# EAGLE design 8_bit_Middle_Rev_A (EAGLE 9.6.0)

## Sheet 1 of 2
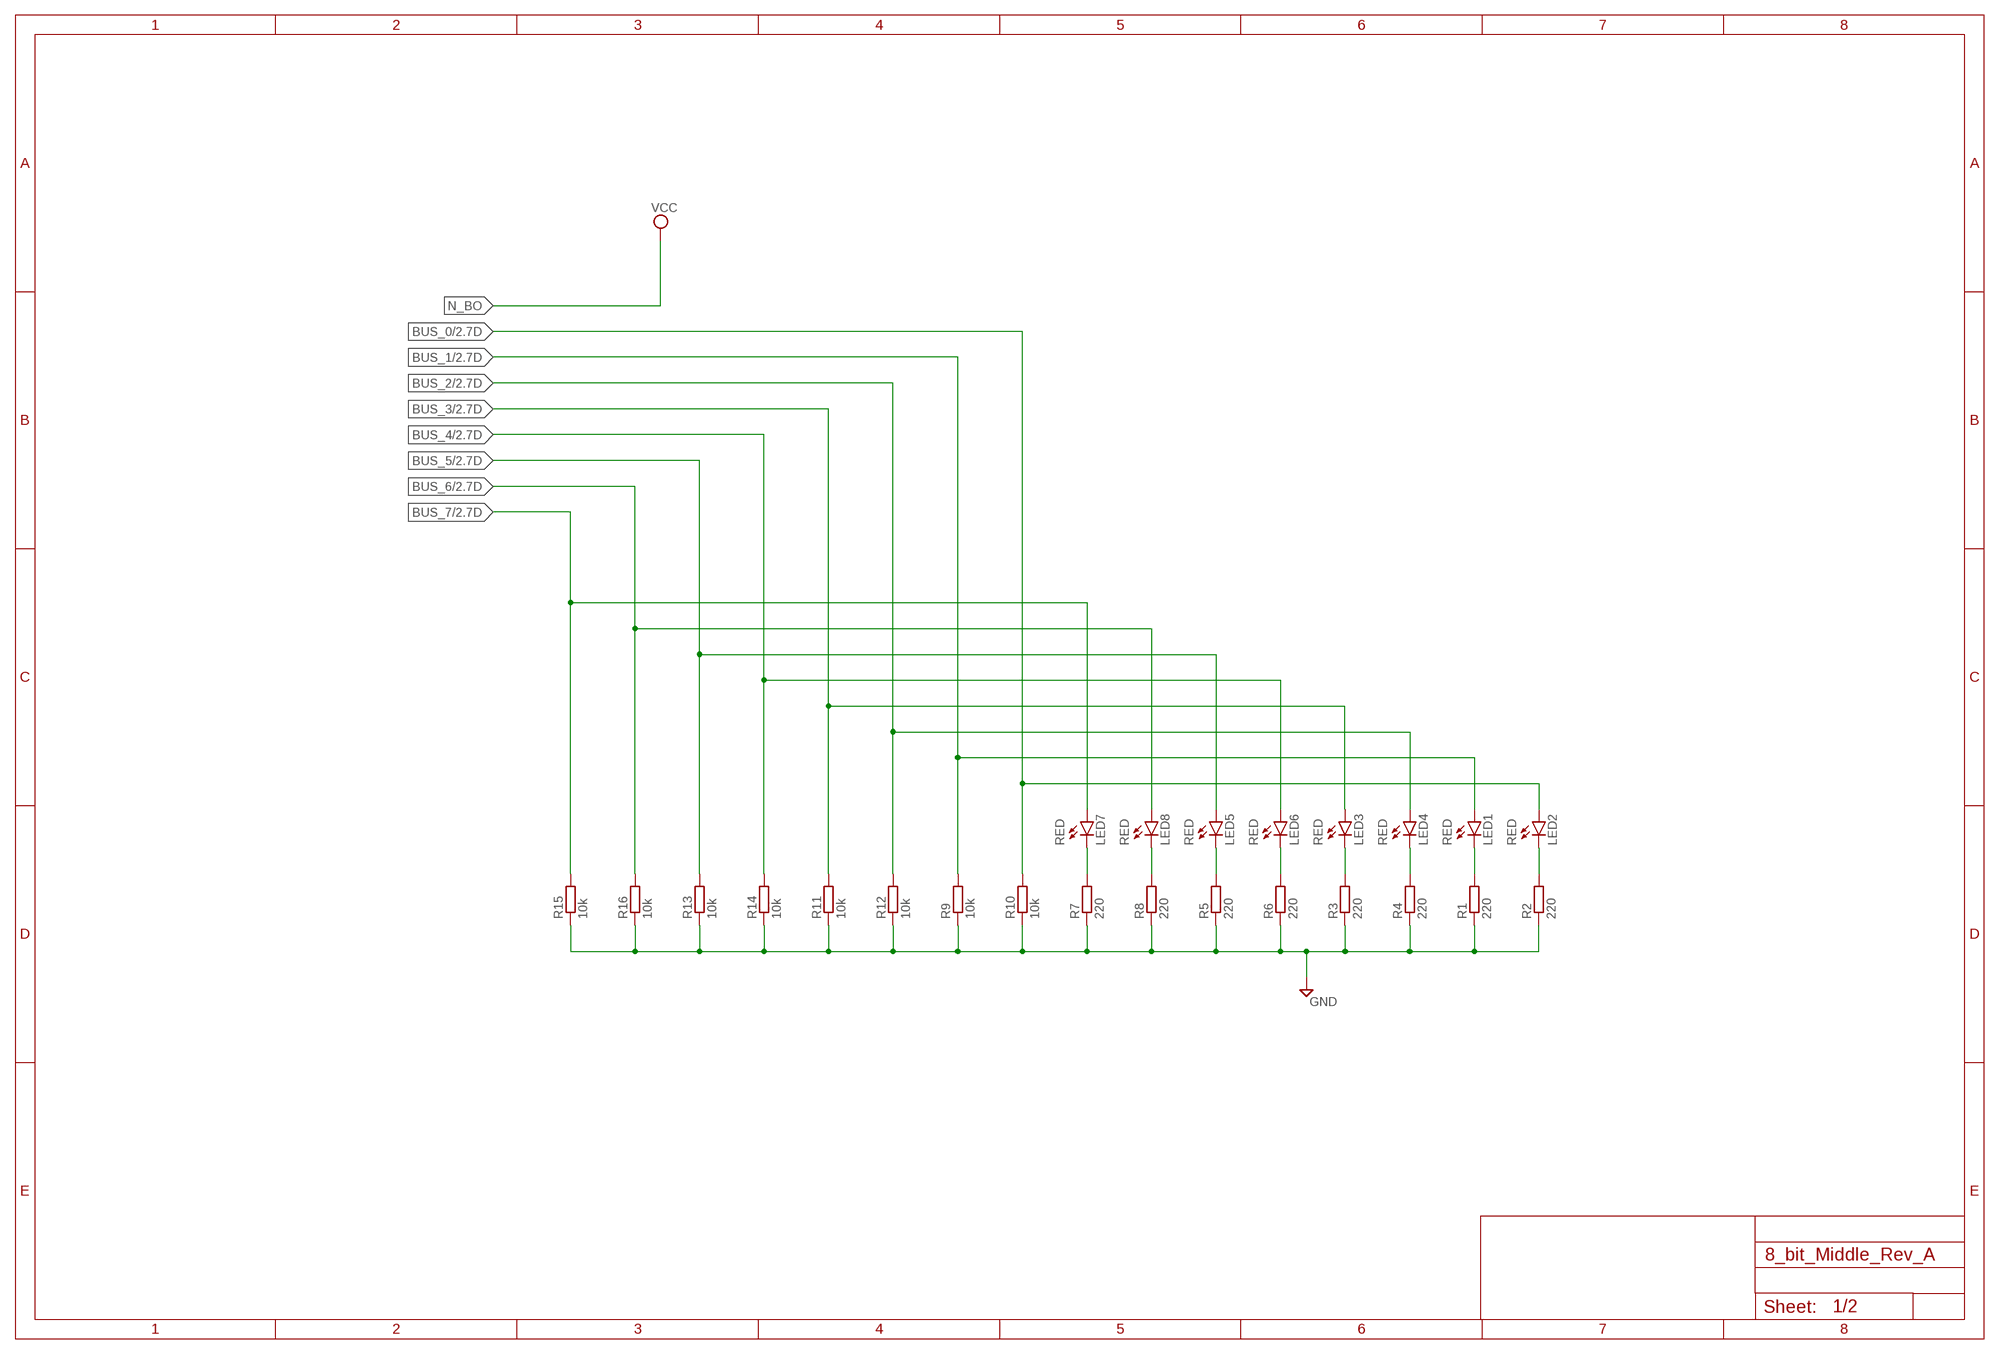
[diagram p0: schematic, sheet 1]

### Parts
LED1  RED  LED5MM  [LED5MM]
LED2  RED  LED5MM  [LED5MM]
LED3  RED  LED5MM  [LED5MM]
LED4  RED  LED5MM  [LED5MM]
LED5  RED  LED5MM  [LED5MM]
LED6  RED  LED5MM  [LED5MM]
LED7  RED  LED5MM  [LED5MM]
LED8  RED  LED5MM  [LED5MM]
R1  220  R-EU_0207/10  [0207/10]
R2  220  R-EU_0207/10  [0207/10]
R3  220  R-EU_0207/10  [0207/10]
R4  220  R-EU_0207/10  [0207/10]
R5  220  R-EU_0207/10  [0207/10]
R6  220  R-EU_0207/10  [0207/10]
R7  220  R-EU_0207/10  [0207/10]
R8  220  R-EU_0207/10  [0207/10]
R9  10k  R-EU_0207/10  [0207/10]
R10  10k  R-EU_0207/10  [0207/10]
R11  10k  R-EU_0207/10  [0207/10]
R12  10k  R-EU_0207/10  [0207/10]
R13  10k  R-EU_0207/10  [0207/10]
R14  10k  R-EU_0207/10  [0207/10]
R15  10k  R-EU_0207/10  [0207/10]
R16  10k  R-EU_0207/10  [0207/10]

### Nets
BUS_0: LED2.A R10.2 ; also sheet 2
BUS_1: LED1.A R9.2 ; also sheet 2
BUS_2: LED4.A R12.2 ; also sheet 2
BUS_3: LED3.A R11.2 ; also sheet 2
BUS_4: LED6.A R14.2 ; also sheet 2
BUS_5: LED5.A R13.2 ; also sheet 2
BUS_6: LED8.A R16.2 ; also sheet 2
BUS_7: LED7.A R15.2 ; also sheet 2
GND: R1.1 R2.1 R3.1 R4.1 R5.1 R6.1 R7.1 R8.1 R9.1 R10.1 R11.1 R12.1 R13.1 R14.1 R15.1 R16.1 ; also sheet 2
GND1: LED1.K(C) R1.2
GND2: LED2.K(C) R2.2
GND3: LED3.K(C) R3.2
GND5: LED4.K(C) R4.2
GND7: LED5.K(C) R5.2
GND8: LED6.K(C) R6.2
GND9: LED7.K(C) R7.2
GND10: LED8.K(C) R8.2

## Sheet 2 of 2
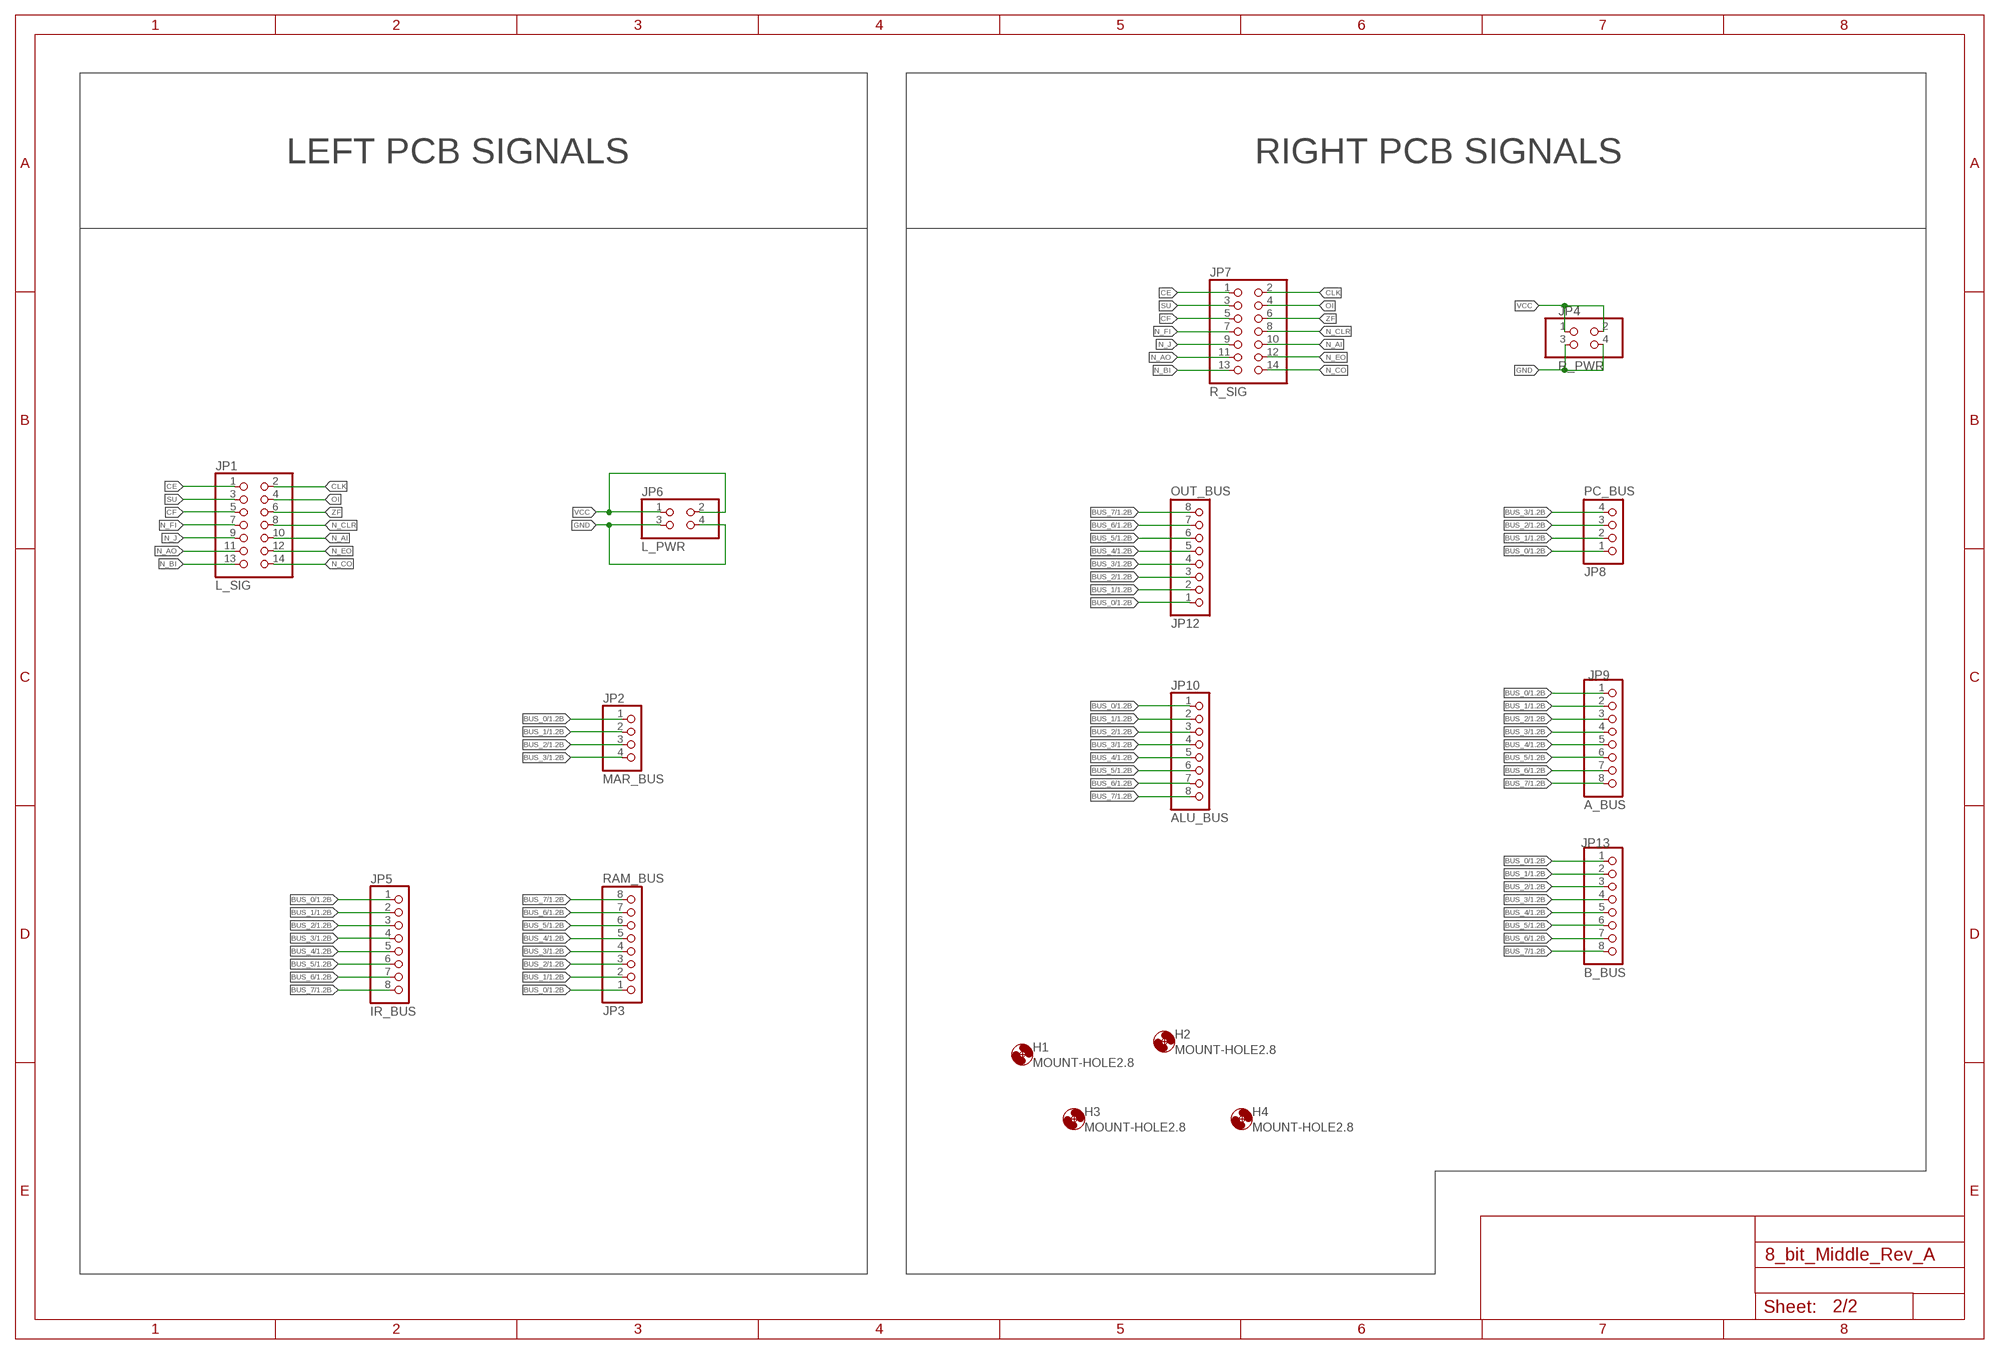
[diagram p1: schematic, sheet 2]

### Parts
H1  MOUNT-HOLE2.8  [2,8]
H2  MOUNT-HOLE2.8  [2,8]
H3  MOUNT-HOLE2.8  [2,8]
H4  MOUNT-HOLE2.8  [2,8]
JP1  L_SIG  PINHD-2X7  [2X07]
JP2  MAR_BUS  PINHD-1X4  [1X04]
JP3  RAM_BUS  PINHD-1X8  [1X08]
JP4  R_PWR  PINHD-2X2  [2X02]
JP5  IR_BUS  PINHD-1X8  [1X08]
JP6  L_PWR  PINHD-2X2  [2X02]
JP7  R_SIG  PINHD-2X7  [2X07]
JP8  PC_BUS  PINHD-1X4  [1X04]
JP9  A_BUS  PINHD-1X8  [1X08]
JP10  ALU_BUS  PINHD-1X8  [1X08]
JP12  OUT_BUS  PINHD-1X8  [1X08]
JP13  B_BUS  PINHD-1X8  [1X08]

### Nets
BUS_0: JP2.1 JP3.1 JP5.1 JP8.1 JP9.1 JP10.1 JP12.1 JP13.1 ; also sheet 1
BUS_1: JP2.2 JP3.2 JP5.2 JP8.2 JP9.2 JP10.2 JP12.2 JP13.2 ; also sheet 1
BUS_2: JP2.3 JP3.3 JP5.3 JP8.3 JP9.3 JP10.3 JP12.3 JP13.3 ; also sheet 1
BUS_3: JP2.4 JP3.4 JP5.4 JP8.4 JP9.4 JP10.4 JP12.4 JP13.4 ; also sheet 1
BUS_4: JP3.5 JP5.5 JP9.5 JP10.5 JP12.5 JP13.5 ; also sheet 1
BUS_5: JP3.6 JP5.6 JP9.6 JP10.6 JP12.6 JP13.6 ; also sheet 1
BUS_6: JP3.7 JP5.7 JP9.7 JP10.7 JP12.7 JP13.7 ; also sheet 1
BUS_7: JP3.8 JP5.8 JP9.8 JP10.8 JP12.8 JP13.8 ; also sheet 1
CE: JP1.1 JP7.1
CF: JP1.5 JP7.5
CLK: JP1.2 JP7.2
GND: JP4.3 JP4.4 JP6.3 JP6.4 ; also sheet 1
N_AI: JP1.10 JP7.10
N_AO: JP1.11 JP7.11
N_BI: JP1.13 JP7.13
N_CLR: JP1.8 JP7.8
N_CO: JP1.14 JP7.14
N_EO: JP1.12 JP7.12
N_FI: JP1.7 JP7.7
N_J: JP1.9 JP7.9
OI: JP1.4 JP7.4
SU: JP1.3 JP7.3
VCC [zasilanie]: JP4.1 JP4.2 JP6.1 JP6.2
ZF: JP1.6 JP7.6

### Notes on the sheet
- LEFT PCB SIGNALS | RIGHT PCB SIGNALS

## Library data of the parts
H1-H4 = holes:MOUNT-HOLE: MOUNTING HOLE with drill center marker
JP1 JP7 = pinhead:PINHD-2X7: PIN HEADER
JP2 JP8 = pinhead:PINHD-1X4: PIN HEADER
JP3 JP5 JP9 JP10 JP12 JP13 = pinhead:PINHD-1X8: PIN HEADER
JP4 JP6 = pinhead:PINHD-2X2: PIN HEADER
LED1-LED8 = led:LED: LED OSRAM: - CHIPLED LG R971, LG N971, LY N971, LG Q971, LY Q971, LO R971, LY R971 LH N974, LH R974 LS Q976, LO Q976, LY Q976 LO Q996 - Hyper CHIPLED LW Q18S LB Q993, LB Q99A, LB R99A - SideLED LS A670, LO A670, LY A670, LG A670, LP A670 LB A673, LV A673, LT A673, LW A673 LH A674 LY A675 LS A676, LA A676, LO A676, LY A676, LW A676 LS A679, LY A679, LG A679 - Hyper Micro SIDELED® LS Y876, LA Y876, LO Y876, LY Y876 LT Y87S - SmartLED LW L88C, LW L88S LB L89C, LB L89S, LG L890 LS L89K, LO L89K, LY L89K LS L896, LA L896, LO L896, LY L896 - TOPLED LS T670, LO T670, LY T670, LG T670, LP T670 LSG T670, LSP T670, LSY T670, LOP T670, LYG T670 LG T671, LOG T671, LSG T671 LB T673, LV T673, LT T673, LW T673 LH T674 LS T676, LA T676, LO T676, LY T676, LB T676, LH T676, LSB T676, LW T676 LB T67C, LV T67C, LT T67C, LS T67K, LO T67K, LY T67K, LW E67C LS E67B, LA E67B, LO E67B, LY E67B, LB E67C, LV E67C, LT E67C LW T67C LS T679, LY T679, LG T679 LS T770, LO T770, LY T770, LG T770, LP T770 LB T773, LV T773, LT T773, LW T773 LH T774 LS E675, LA E675, LY E675, LS T675 LS T776, LA T776, LO T776, LY T776, LB T776 LHGB T686 LT T68C, LB T68C - Hyper Mini TOPLED® LB M676 - Mini TOPLED Santana® LG M470 LS M47K, LO M47K, LY M47K Source: http://www.osram.convergy.de LUXEON: - LUMILED® LXK2-PW12-R00, LXK2-PW12-S00, LXK2-PW14-U00, LXK2-PW14-V00 LXK2-PM12-R00, LXK2-PM12-S00, LXK2-PM14-U00 LXK2-PE12-Q00, LXK2-PE12-R00, LXK2-PE12-S00, LXK2-PE14-T00, LXK2-PE14-U00 LXK2-PB12-K00, LXK2-PB12-L00, LXK2-PB12-M00, LXK2-PB14-N00, LXK2-PB14-P00, LXK2-PB14-Q00 LXK2-PR12-L00, LXK2-PR12-M00, LXK2-PR14-Q00, LXK2-PR14-R00 LXK2-PD12-Q00, LXK2-PD12-R00, LXK2-PD12-S00 LXK2-PH12-R00, LXK2-PH12-S00 LXK2-PL12-P00, LXK2-PL12-Q00, LXK2-PL12-R00 Source: www.luxeon.com KINGBRIGHT: KA-3528ASYC Source: www.kingbright.com
R1-R16 = rcl:R-EU_: RESISTOR, European symbol; SPICEPREFIX: R

## Net classes
1 zasilanie: width 0.508 mm

## Board
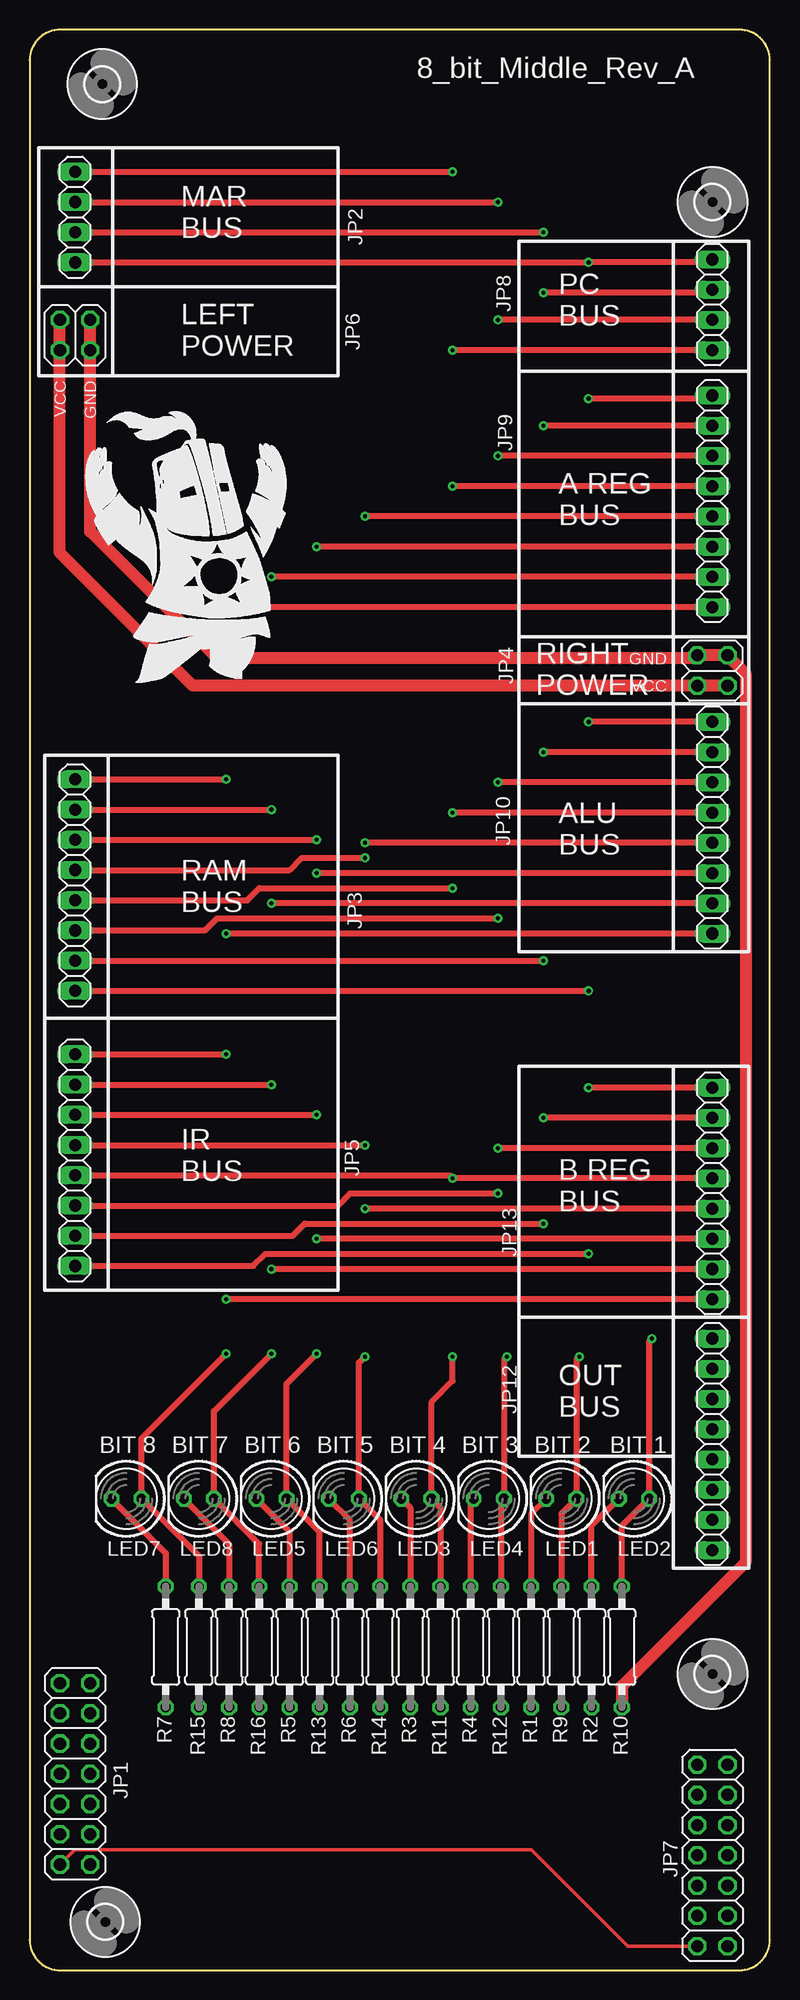
[diagram p2: board, top side]
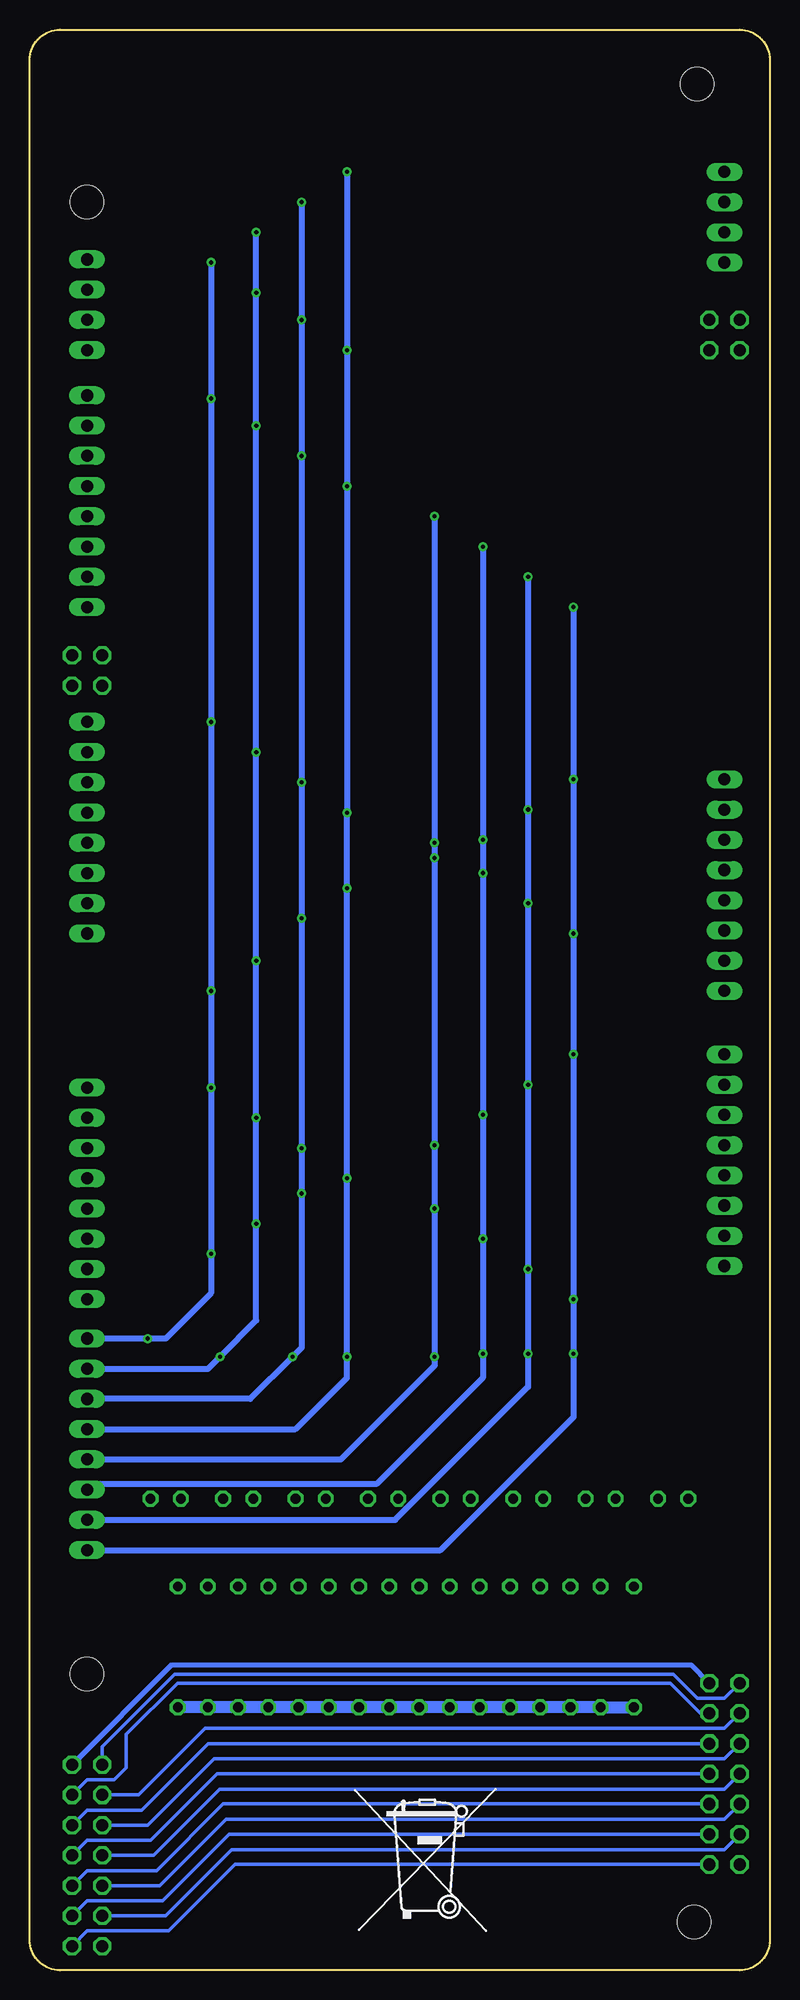
[diagram p3: board, bottom side, seen from below]

Size 62.23 x 163.07 mm. Coordinates in mm from the lower left corner, seen from the top.
Outline: 0,160.53 0,2.54 arc90 2.54,0 59.69,0 arc90 62.23,2.54 62.23,160.53 arc90 59.69,163.07 2.54,163.07 arc90 0,160.53
Copper layers (1*16): Top 0.035mm / dielectric 1.5mm / Bottom 0.035mm
Design rules "default": minimum track width 6mil, minimum drill 0.35mm, track to track 6mil, track to pad 6mil, pad to pad 6mil, via to via 6mil, smd to smd 6mil, copper to edge 40mil, drill to drill 6mil, minimum pad ring 10mil, minimum via ring 8mil, stop-mask expansion 4mil, vias tented up to drill 0mil, thermal gap 10mil

### Footprints (pad centres in the part's own frame; a part is rotated, then mirrored left to right if it is on the bottom)
2,8 = hole 2.8: 0,0
2X07 = drill 1.016 octagon: 1 -7.62,-1.27; 2 -7.62,1.27; 3 -5.08,-1.27; 4 -5.08,1.27; 5 -2.54,-1.27; 6 -2.54,1.27; 7 0,-1.27; 8 0,1.27; 9 2.54,-1.27; 10 2.54,1.27; 11 5.08,-1.27; 12 5.08,1.27; 13 7.62,-1.27; 14 7.62,1.27
1X04 = drill 1.016 long: 1 -3.81,0; 2 -1.27,0; 3 1.27,0; 4 3.81,0
1X08 = drill 1.016 long: 1 -8.89,0; 2 -6.35,0; 3 -3.81,0; 4 -1.27,0; 5 1.27,0; 6 3.81,0; 7 6.35,0; 8 8.89,0
2X02 = drill 1.016 octagon: 1 -1.27,-1.27; 2 -1.27,1.27; 3 1.27,-1.27; 4 1.27,1.27
LED5MM = drill 0.813 octagon: A -1.27,0; K 1.27,0
0207/10 = drill 0.813 octagon: 1 -5.08,0; 2 5.08,0

### Placement (x,y rotation side)
H1  6.35,4.06 0 top
H2  6.1,158.5 0 top
H3  57.4,24.89 0 top
H4  57.4,148.59 0 top
JP1  3.81,16.51 270 top
JP2  3.81,147.32 90 top
JP3  3.81,91.19 90 top
JP4  57.4,109.22 90 top
JP5  3.81,68.07 90 top
JP6  3.81,137.41 0 top
JP7  57.4,9.65 270 top
JP8  57.4,139.95 270 top
JP9  57.4,123.44 270 top
JP10  57.4,96.01 270 top
JP12  57.4,44.2 270 top
JP13  57.4,65.28 270 top
LED1  44.7,39.62 180 top
LED2  50.8,39.62 180 top
LED3  32.51,39.62 180 top
LED4  38.61,39.62 180 top
LED5  20.32,39.62 180 top
LED6  26.42,39.62 180 top
LED7  8.13,39.62 180 top
LED8  14.22,39.62 180 top
R1  42.16,27.18 90 top
R2  47.24,27.18 90 top
R3  32,27.18 90 top
R4  37.08,27.18 90 top
R5  21.84,27.18 90 top
R6  26.92,27.18 90 top
R7  11.43,27.18 90 top
R8  16.76,27.18 90 top
R9  44.7,27.18 90 top
R10  49.78,27.18 90 top
R11  34.54,27.18 90 top
R12  39.62,27.18 90 top
R13  24.38,27.18 90 top
R14  29.46,27.18 90 top
R15  14.22,27.18 90 top
R16  19.3,27.18 90 top
U$1  [SOLAIRE]  1.24,105.99 0 top
U$2  [MUELLTONNE]  35.66,2.82 0 bottom

### Tracks (layer width: path | path; a pad name or v marks a point on that pad's centre or on a via)
BUS_0  (via drill 0.35)
  Top 0.508: JP2.1 v46.99,143.51 57.15,143.51 JP8.1 | JP9.1 57.15,132.08 v46.99,132.08 | JP10.1 v46.99,104.9 | JP3.1 v46.99,82.3 | JP13.1 v46.99,74.17 | JP5.1 18.8,59.18 19.81,60.2 v46.99,60.2 | R10.2 49.78,37.34 LED2.A 52.07,52.83 v52.32,53.09
  Bottom 0.508: v46.99,143.51 v46.99,132.08 v46.99,104.9 v46.99,82.3 v46.99,74.17 v46.99,60.2 46.99,56.9 50.8,53.09 v52.32,53.09 JP12.1
BUS_1  (via drill 0.35)
  Top 0.508: JP2.2 v43.18,146.05 | JP8.2 57.15,140.97 v43.18,140.97 | JP9.2 v43.18,129.79 | JP10.2 v43.18,102.36 | JP3.2 v43.18,84.84 | JP13.2 v43.18,71.63 | JP5.2 22.1,61.72 23.11,62.74 v43.18,62.74 | R9.2 44.7,38.35 LED1.A 45.97,51.31 v46.23,51.56
  Bottom 0.508: JP12.2 47.24,50.55 v46.23,51.56 43.18,54.61 v43.18,62.74 v43.18,71.63 v43.18,84.84 v43.18,102.36 v43.18,129.79 v43.18,140.97 v43.18,146.05
BUS_2  (via drill 0.35)
  Top 0.508: JP2.3 v39.37,148.59 | JP8.3 v39.37,138.68 | JP9.3 v39.37,127.25 | JP10.3 v39.37,99.82 | JP3.3 14.73,87.38 15.75,88.39 v39.37,88.39 | JP13.3 v39.37,69.09 | JP5.3 25.91,64.26 26.92,65.28 v39.37,65.28 | R12.2 39.62,39.37 LED4.A 39.88,51.31 v40.13,51.56
  Bottom 0.508: JP12.3 43.69,48.01 v40.13,51.56 39.37,52.32 v39.37,65.28 v39.37,69.09 v39.37,88.39 v39.37,99.82 v39.37,127.25 v39.37,138.68 v39.37,148.59
BUS_3  (via drill 0.35)
  Top 0.508: JP2.4 v35.56,151.13 | JP8.4 v35.56,136.14 | JP9.4 v35.56,124.71 | JP10.4 v35.56,97.28 | JP3.4 18.29,89.92 19.3,90.93 v35.56,90.93 | JP13.4 v35.56,66.55 35.31,66.8 JP5.4 | R11.2 34.54,38.86 LED3.A 33.78,47.75 35.56,49.53 v35.56,51.56
  Bottom 0.508: JP12.4 39.88,45.47 35.56,49.78 v35.56,51.56 v35.56,66.55 v35.56,90.93 v35.56,97.28 v35.56,124.71 v35.56,136.14 v35.56,151.13
BUS_4  (via drill 0.35)
  Top 0.508: JP9.5 v28.19,122.17 | JP10.5 v28.19,94.74 | JP3.5 21.84,92.46 22.86,93.47 v28.19,93.47 | JP13.5 v28.19,64.01 | JP5.5 v28.19,69.34 | R14.2 29.46,37.85 LED6.A 27.69,51.05 v28.19,51.56
  Bottom 0.508: v28.19,122.17 v28.19,94.74 v28.19,93.47 v28.19,69.34 v28.19,64.01 v28.19,51.56 28.19,50.8 36.07,42.93 JP12.5
BUS_5  (via drill 0.35)
  Top 0.305: 21.72,39.5 LED5.A
  Top 0.508: JP9.6 v24.13,119.63 | JP10.6 v24.13,92.2 | JP3.6 v24.13,95 | JP13.6 v24.13,61.47 | JP5.6 v24.13,71.88 | R13.2 24.38,36.83 21.72,39.5 | LED5.A 21.59,49.28 v24.13,51.82
  Bottom 0.508: v24.13,119.63 v24.13,95 v24.13,92.2 v24.13,71.88 v24.13,61.47 v24.13,51.82 24.13,49.78 33.02,40.89 56.9,40.89 JP12.6
BUS_6  (via drill 0.35)
  Top 0.508: JP9.7 v20.32,117.09 | JP10.7 v20.32,89.66 | JP3.7 v20.32,97.54 | JP13.7 v20.32,58.93 | JP5.7 v20.32,74.42 | R16.2 19.3,35.81 LED8.A 15.49,46.99 v20.32,51.82
  Bottom 0.508: v20.32,117.09 v20.32,97.54 v20.32,89.66 v20.32,74.42 v20.32,58.93 v20.32,51.82 20.32,49.02 31.5,37.85 JP12.7
BUS_7  (via drill 0.35)
  Top 0.508: JP9.8 v16.51,114.55 | JP10.8 v16.51,87.12 | JP3.8 v16.51,100.08 | JP13.8 v16.51,56.39 | JP5.8 v16.51,76.96 | R15.2 14.22,34.8 LED7.A 9.4,44.7 v16.51,51.82
  Bottom 0.508: v16.51,114.55 v16.51,100.08 v16.51,87.12 v16.51,76.96 v16.51,56.39 v16.51,51.82 16.51,46.48 27.69,35.31 JP12.8
CE
  Bottom 0.305: JP7.1 56.13,18.8 50.04,24.89 8.13,24.89 6.1,22.86 3.81,22.86 JP1.1
CF
  Bottom 0.305: JP1.5 3.81,17.78 46.74,17.78 52.32,12.19 JP7.5
CLK
  Bottom 0.406: JP1.2 6.6,25.65 50.29,25.65 JP7.2
GND
  Top 1.016: R10.1 49.78,23.88 60.2,34.29 60.2,108.97 JP4.3 JP4.4 55.88,110.24 15.75,110.24 5.08,120.9 JP6.3 JP6.4
  Bottom 1.016: R7.1 R15.1 R8.1 R16.1 R5.1 R13.1 R6.1 R14.1 R3.1 R11.1 R4.1 R12.1 R1.1 R9.1 R2.1 R10.1
GND1
  Top 0.508: R1.2 42.16,38.35 LED1.K
GND2
  Top 0.508: R2.2 47.24,37.34 LED2.K
GND3
  Top 0.508: R3.2 32,38.86 LED3.K
GND5
  Top 0.508: R4.2 37.08,39.37 LED4.K
GND7
  Top 0.508: LED5.K 21.84,36.83 R5.2
GND8
  Top 0.508: R6.2 26.92,37.85 LED6.K
GND9
  Top 0.508: LED7.K 11.43,35.05 R7.2
GND10
  Top 0.508: LED8.K 16.76,35.81 R8.2
N_AI
  Bottom 0.305: JP1.10 5.11,13.99 45.95,13.99 51.56,8.38 57.4,8.38 JP7.10
N_AO
  Bottom 0.305: JP1.11 3.83,10.13 45.24,10.13 50.8,4.57 JP7.11
N_BI
  Top 0.305: JP1.13 3.79,10.13 42.19,10.13 50.29,2.03 JP7.13
N_CLR
  Bottom 0.305: JP1.8 46.48,16.51 52.07,10.92 57.4,10.92 JP7.8
N_CO
  Bottom 0.305: JP1.14 44.96,8.89 50.55,3.3 57.4,3.3 JP7.14
N_EO
  Bottom 0.305: JP7.12 57.4,5.84 51.05,5.84 45.47,11.43 JP1.12
N_FI
  Bottom 0.305: JP1.7 3.83,15.21 46.25,15.21 51.82,9.65 JP7.7
N_J
  Bottom 0.305: JP1.9 3.81,12.7 45.72,12.7 51.31,7.11 JP7.9
OI
  Bottom 0.305: JP7.4 57.4,16 55.12,16 54.1,17.02 54.1,19.81 49.78,24.13 8.38,24.13 5.84,21.59 JP1.4
SU
  Bottom 0.305: JP1.3 3.81,20.32 47.5,20.32 53.09,14.73 JP7.3
VCC
  Top 1.016: JP4.1 JP4.2 13.72,107.95 2.54,119.13 JP6.1 JP6.2
ZF
  Bottom 0.305: JP1.6 47.24,19.05 52.83,13.46 57.4,13.46 JP7.6

### Text on the board
tPlace: MAR / BUS | PC / BUS | LEFT / POWER | VCC | GND | A REG / BUS | GND | VCC | RIGHT / POWER | ALU / BUS | RAM / BUS | IR / BUS | B REG / BUS | OUT / BUS | BIT 8 | BIT 7 | BIT 6 | BIT 5 | BIT 4 | BIT 3 | BIT 2 | BIT 1